# Altium schematic sheet Power_PMIC.SchDoc: Power_PMIC
size A3; CompanyName: STMicroelectronics; Organization: Microcontrollers Division; Address1: 12, Rue Jules HOROWITZ; Address2: 38019 Grenoble; Address3: FRANCE; SheetNumber: 5; SheetTotal: 7
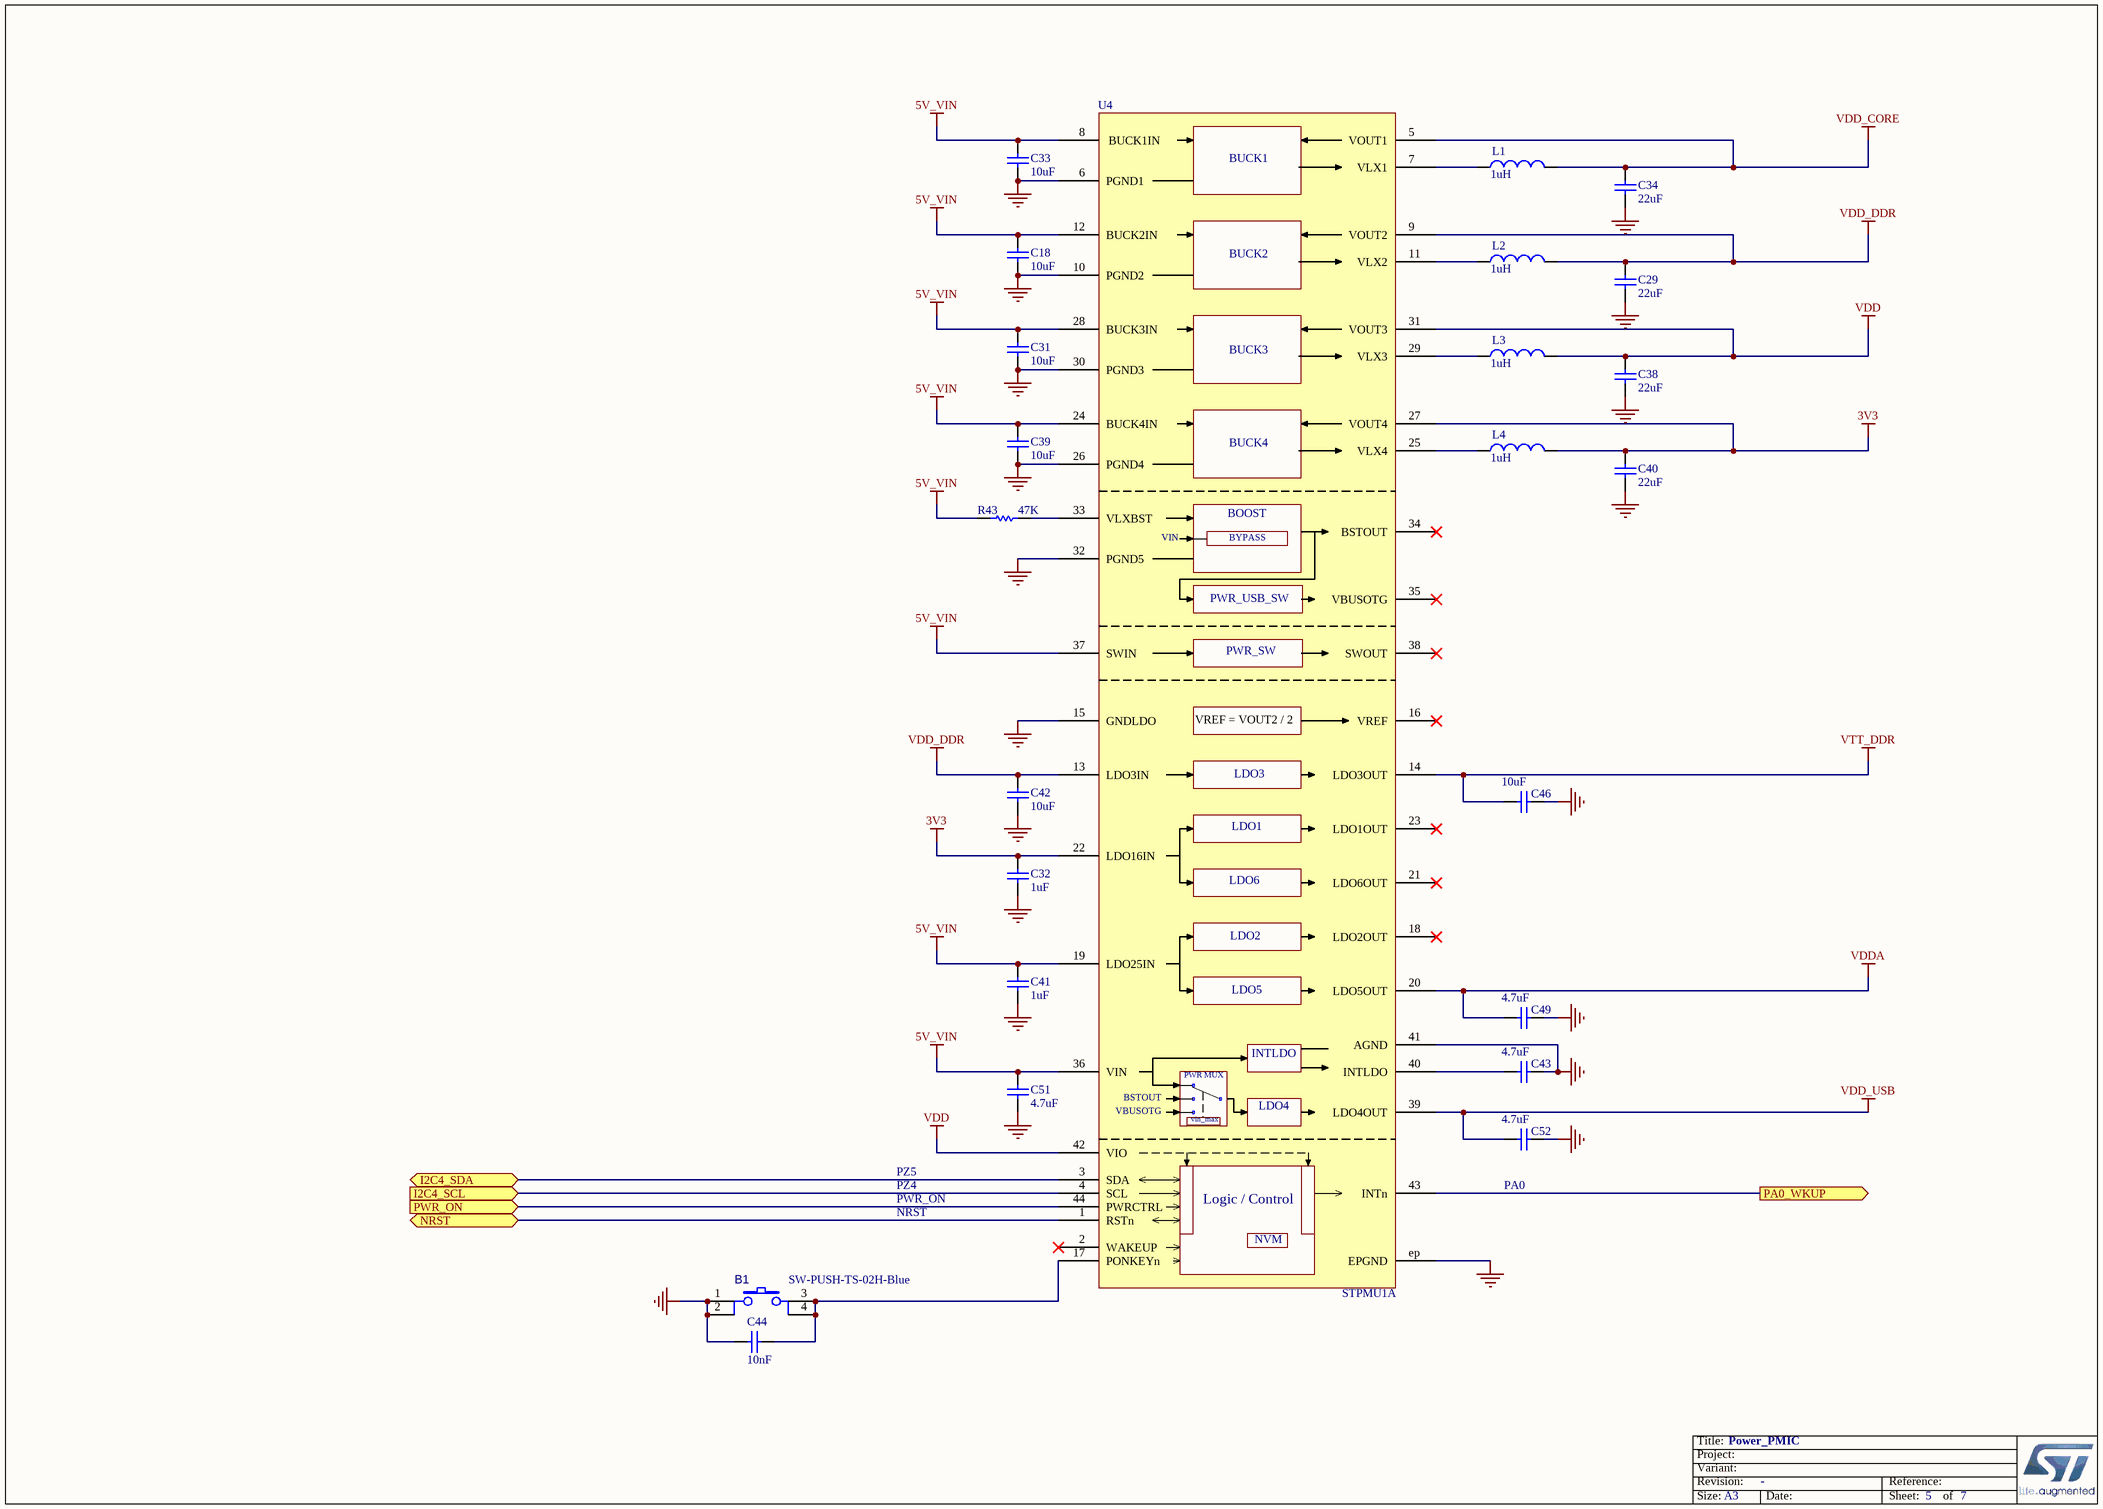
[diagram p0: Power_PMIC.SchDoc]

## Parts
B1  value SW-PUSH-TS-02H-Blue  [SWI_JIUBABA_C-TS-02H-2-5-B-V-T_R_BLUE]
C18  value 10uF  [C0603]
C29  value 22uF  [C0603]
C31  value 10uF  [C0603]
C32  value 1uF  [C0402]
C33  value 10uF  [C0603]
C34  value 22uF  [C0603]
C38  value 22uF  [C0603]
C39  value 10uF  [C0603]
C40  value 22uF  [C0603]
C41  value 1uF  [C0402]
C42  value 10uF  [C0603]
C43  value 4.7uF  [C0402]
C44  value 10nF  [C0402]
C46  value 10uF  [C0603]
C49  value 4.7uF  [C0402]
C51  value 4.7uF  [C0402]
C52  value 4.7uF  [C0402]
L1  value 1uH  [IND_2520_TOKO_DFE252012P]
L2  value 1uH  [IND_2520_TOKO_DFE252012P]
L3  value 1uH  [IND_2520_TOKO_DFE252012P]
L4  value 1uH  [IND_2520_TOKO_DFE252012P]
R43  value 47K  [R0402]
U4  value STPMU1A  [ICC_WFQFN44-EPAD_5X6_P040]

## Ports
I2C4_SCL (in), I2C4_SDA (bidir), NRST (bidir), PA0_WKUP (out), PWR_ON (in)

## Nets
3V3: C32.2 C40.2 L4.2 U4.22(LDO16IN) U4.27(VOUT4)
5V_VIN: C18.2 C31.2 C33.2 C39.2 C41.2 C51.2 R43.2 U4.8(BUCK1IN) U4.12(BUCK2IN) U4.19(LDO25IN) U4.24(BUCK4IN) U4.28(BUCK3IN) U4.36(VIN) U4.37(SWIN)
GND: B1.1 B1.2 C18.1 C29.1 C31.1 C32.1 C33.1 C34.1 C38.1 C39.1 C40.1 C41.1 C42.1 C43.2 C44.1 C46.1 C49.1 C51.1 C52.1 U4.6(PGND1) U4.10(PGND2) U4.15(GNDLDO) U4.26(PGND4) U4.30(PGND3) U4.32(PGND5) U4.41(AGND) U4.ep(EPGND)
VDD: C38.2 L3.2 U4.31(VOUT3) U4.42(VIO)
VDD_CORE: C34.2 L1.2 U4.5(VOUT1)
VDD_DDR: C29.2 C42.2 L2.2 U4.9(VOUT2) U4.13(LDO3IN)
VDD_USB: C52.2 U4.39(LDO4OUT)
VDDA: C49.2 U4.20(LDO5OUT)
VTT_DDR: C46.2 U4.14(LDO3OUT)
I2C4_SCL: U4.4(SCL) ; port I2C4_SCL
I2C4_SDA: U4.3(SDA) ; port I2C4_SDA
NRST: U4.1(RSTn) ; port NRST
PA0_WKUP: U4.43(INTn) ; port PA0_WKUP
PWR_ON: U4.44(PWRCTRL) ; port PWR_ON
NetB1_3: B1.3 B1.4 C44.2 U4.17(PONKEYn)
NetC43_1: C43.1 U4.40(INTLDO)
NetL1_1: L1.1 U4.7(VLX1)
NetL2_1: L2.1 U4.11(VLX2)
NetL3_1: L3.1 U4.29(VLX3)
NetL4_1: L4.1 U4.25(VLX4)
NetR43_1: R43.1 U4.33(VLXBST)

Not connected (* = marked no-connect by the designer): U4 2(WAKEUP)* 16(VREF)* 18(LDO2OUT)* 21(LDO6OUT)* 23(LDO1OUT)* 34(BSTOUT)* 35(VBUSOTG)* 38(SWOUT)*

## Notes on the sheet
- PZ5
- PZ4
- (near C52) PA0
- NRST
- PWR_ON
- Title:
- Project:
- Size:
- Revision:
- Variant:
- A3
- -
- Date:
- Reference:
- Sheet:
- of
- (in symbol MCD-00303) BUCK1; BUCK2; BUCK3; BUCK4; BOOST; BYPASS; PWR_USB_SW; PWR_SW; VREF = VOUT2 / 2; LDO3; LDO1; LDO6; LDO2; LDO5; PWR MUX; LDO4; vin_max; Logic / Control; NVM

## Library data of the parts
B1 = MCD-00172: Switch HW SMD blue; Part_Type: Misc; Manufacturer_Part_Number: C-TS-02H-2.5-B-V-T/R BLUE; Manufacturer: JIUBABA; Provided_By: SUBCO; Internal_Part_Number: MCD-00172; Status: Checked; ComponentLink1Description: Datasheet; ComponentLink1URL: http://tunmcdsvn.tun.st.com/Component_Datasheet_Library/Trunk/Misc/Jiubaba_TS-02H-H2-5; ECCN_US: n/a; ECCN_EU: n/a
C18 C31 C33 C39 C42 = MCD-00099: Capacitor, MLCC, 10uF, 10V, X5R, 10%, 0603, T=0,8mm; Manufacturer_Part_Number: GRM188R61A106KE69D; Manufacturer: MURATA; Provided_By: SUBCO; ECCN_US: EAR99; ECCN_EU: NEC; Internal_Part_Number: MCD-00099; Status: Released; Part_Type: Capacitor; Package: C0603; ComponentLink1Description: Datasheet; ComponentLink1URL: http://tunmcdsvn.tun.st.com/Component_Datasheet_Library/Trunk/Capacitors/Murata_Capacitor_GR_series
C29 C34 C38 C40 = MCD-00100: Capacitor, MLCC, 22uF, 6V3, X5R, 20%, 0603, T=0,8mm; Manufacturer_Part_Number: GRM188R60J226MEA0J; Manufacturer: MURATA; Provided_By: SUBCO; ECCN_US: EAR99; ECCN_EU: NEC; Internal_Part_Number: MCD-00100; Status: Released; Part_Type: Capacitor; Package: C0603; ComponentLink1Description: Datasheet; ComponentLink1URL: http://tunmcdsvn.tun.st.com/Component_Datasheet_Library/Trunk/Capacitors/Murata_Capacitor_GR_series
C32 C41 = MCD-00095: Capacitor, MLCC, 1uF, 25V, X5R, 10%, 0402, T=0,5mm; Manufacturer_Part_Number: GRM155R61E105KA12; Manufacturer: MURATA; Alternate_Manufacturer_Part_Number: GRM155R60J105KE19; Provided_By: SUBCO; ECCN_US: EAR99; ECCN_EU: NEC; Internal_Part_Number: MCD-00095; Status: Released; Part_Type: Capacitor; Package: C0402; ComponentLink1Description: Datasheet; ComponentLink1URL: http://tunmcdsvn.tun.st.com/Component_Datasheet_Library/Trunk/Capacitors/Murata_Capacitor_GR_series; Alternate_Manufacturer: MURATA
C43 C49 C51 C52 = MCD-00096: Capacitor, MLCC, 4.7uF, 6V3, X5R, 20%, 0402, T=0,5mm; Manufacturer_Part_Number: GRM155R60J475ME87; Manufacturer: MURATA; Provided_By: SUBCO; ECCN_US: EAR99; ECCN_EU: NEC; Internal_Part_Number: MCD-00096; Status: Obsolete; Part_Type: Capacitor; Package: C0402; ComponentLink1Description: Datasheet; ComponentLink1URL: http://tunmcdsvn.tun.st.com/Component_Datasheet_Library/Trunk/Capacitors/Murata_Capacitor_GR_series
C44 = MCD-00011: Capacitor, MLCC, 10nF, 16V, X7R, 10%, 0402, T=0.5mm; Manufacturer_Part_Number: CC0402KRX7R7BB103; Manufacturer: YAGEO; Provided_By: SUBCO; ECCN_US: EAR99; ECCN_EU: NEC; Internal_Part_Number: MCD-00011; Status: Released; Part_Type: Capacitor; Package: C0402; ComponentLink1Description: Datasheet; ComponentLink1URL: http://tunmcdsvn.tun.st.com/Component_Datasheet_Library/Trunk/Capacitors/Yageo_Multilayer_Capacitor_X7R_series_100pF_to_22uF
C46 = MCD-00099: Capacitor, MLCC, 10uF, 10V, X5R, 10%, 0603, T=0,8mm; Manufacturer_Part_Number: GRM188R61A106KE69D; Manufacturer: MURATA; ECCN_US: EAR99; ECCN_EU: NEC; Provided_By: SUBCO; Internal_Part_Number: MCD-00099; Status: Released; Part_Type: Capacitor; Package: C0603; ComponentLink1Description: Datasheet; ComponentLink1URL: http://tunmcdsvn.tun.st.com/Component_Datasheet_Library/Trunk/Capacitors/Murata_Capacitor_GR_series
L1-L4 = MCD-01122: Power Inductor ,1uH,4.3A max,+/-20%,0.042ohm,2520; Manufacturer_Part_Number: DFE252012P-1ROM=P2; Manufacturer: MURATA; Provided_By: SUBCO; ECCN_US: EAR99; Internal_Part_Number: MCD-01122; Status: Footprint available; Part_Type: Inductor; Package: 2520; ComponentLink1Description: Datasheet; ComponentLink1URL: http://tunmcdsvn.tun.st.com/Component_Datasheet_Library/Trunk/Inductors/Murata_Power_inductors_DFE252012P-1ROM=P2/Murata_Power_inductors_dfe252012p.pdf; ECCN_EU: EAR99
R43 = MCD-00063: Resistor,47K,0402,1%,1/16W; Manufacturer_Part_Number: RC0402FR-0747KL; Manufacturer: YAGEO; Provided_By: SUBCO; ECCN_US: EAR99; ECCN_EU: NEC; Internal_Part_Number: MCD-00063; Status: Released; Part_Type: Resistor; Package: R0402; ComponentLink1Description: Datasheet; ComponentLink1URL: http://tunmcdsvn.tun.st.com/Component_Datasheet_Library/Trunk/Resistors/Yageo_Resistor_RC0402-series
U4 = MCD-00303: STM PMIC WFQFN 5.0x6.0x0.80 44L 0.4 pitch; Part_Type: IC; Manufacturer_Part_Number: STPMU1APQR; Manufacturer: STMICROELECTRONICS; BMS_Part_Number: 9177718; Provided_By: SUBCO with ST control; ECCN_US: EAR99; ECCN_EU: NEC; Internal_Part_Number: MCD-00303; Status: Obsolete; ComponentLink1Description: Datasheet; ComponentLink1URL: http://tunmcdsvn.tun.st.com/Component_Datasheet_Library/Trunk/IC/STM_PMIC_LuftBurg_5x6_44L_20_01_2016